# EAGLE schematic ILX544A_V1_B1 (EAGLE 7.0.0)
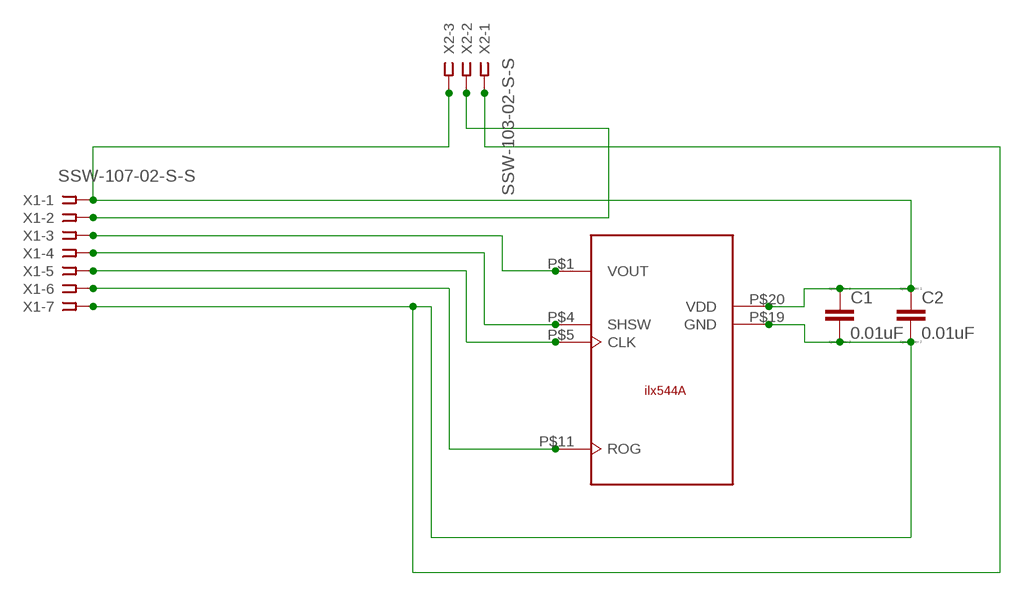
[diagram p0: schematic, sheet 1]

## Parts
C1  0.01uF  CC0402  [C0402]
C2  0.01uF  CC0402  [C0402]
U$1  CCD1  ILX544A  [ILX544A]
X1  SSW-107-02-S-S  [SSW-107-02-S-S]
X2  SSW-103-02-S-S  [SSW-103-02-S-S]

## Nets
N$1: U$1.P$5(CLK) X1.5
N$2: C1.1 C2.1 U$1.P$20(VDD) X1.1 X2.3
N$3: U$1.P$1(VOUT) X1.3
N$4: U$1.P$4(SHSW) X1.4
N$6: U$1.P$11(ROG) X1.6
N$14: X1.2 X2.2
N$15: C1.2 C2.2 U$1.P$19(GND) X1.7 X2.1

## Library data of the parts
C1 C2 = eagle-ltspice:C: CAPACITOR, European symbol; SPICEMODEL: NONE; SPICEPREFIX: C
U$1 = ILX544A:ILX544A: Sony linear CCD
X1 = con-samtec:SSW-107-02-S-S: THROUGH-HOLE .025" SQ POST SOCKET Source: Samtec SSW.pdf; MPN: SSW-107-02-S-S; OC_FARNELL: unknown; OC_NEWARK: 11P9433
X2 = con-samtec:SSW-103-02-S-S: THROUGH-HOLE .025" SQ POST SOCKET Source: Samtec SSW.pdf; MPN: SSW-103-02-S-S; OC_FARNELL: unknown; OC_NEWARK: 11P9367